# Altium schematic sheet общая плата.SchDoc
size A3
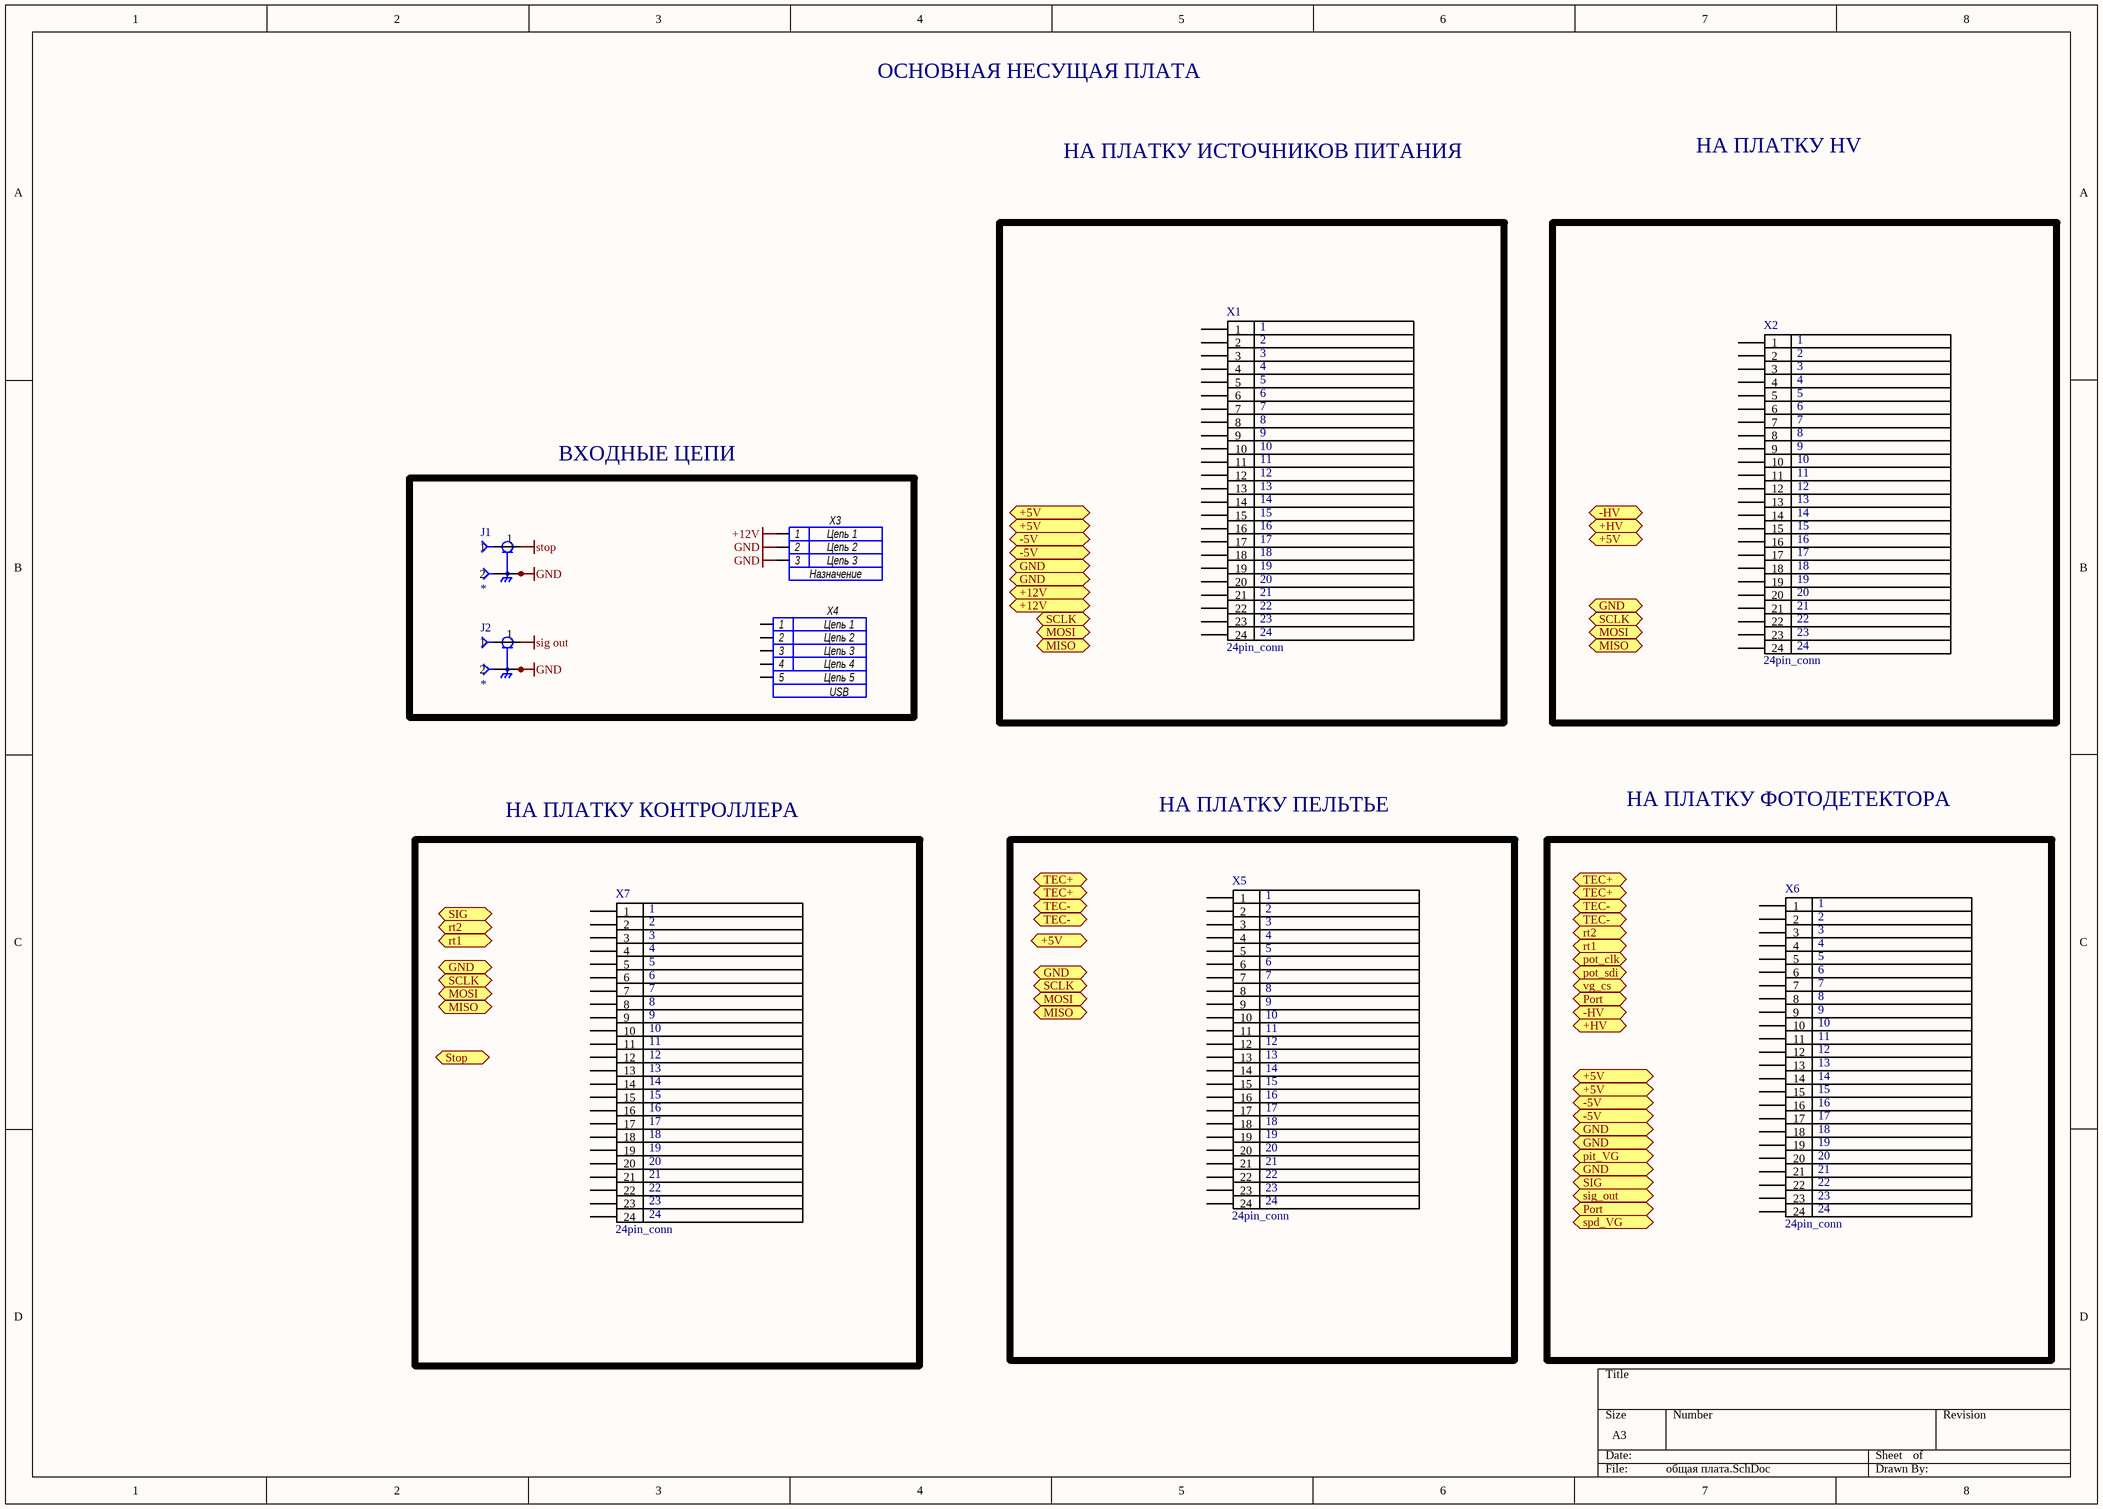
[diagram p0: общая плата.SchDoc]

## Parts
J1  221790-1  [TE_221790-1]  (value not drawn)
J2  221790-1  [TE_221790-1]  (value not drawn)
X1  24pin_conn  [BH-24]
X2  24pin_conn  [BH-24]
X3  Net1: Цепь 1  Net2: Цепь 2  Name: Назначение  Net3: Цепь 3  [DC210]  (hidden comment: Model)
X4  Net4: Цепь 4  Net1: Цепь 1  Net2: Цепь 2  Name: USB  Net3: Цепь 3  Net5: Цепь 5  [USB_TypeB]  (hidden comment: Model)
X5  24pin_conn  [BH-24]
X6  24pin_conn  [BH-24]
X7  24pin_conn  [BH-24]

## Ports
+5V, +12V, +HV, -5V, -HV, GND, MISO, MOSI, pit_VG, Port, pot_clk, pot_sdi, rt1, rt2, SCLK, SIG, sig_out, spd_VG, Stop, TEC+, TEC-, vg_cs

## Nets
+12V: X3.1
GND: J1.2 J1.3 J1.4 J1.5 J2.2 J2.3 J2.4 J2.5 X3.2 X3.3
sig out: J2.1
stop: J1.1

Not connected (* = marked no-connect by the designer): X1 1 2 3 4 5 6 7 8 9 10 11 12 13 14 15 16 17 18 19 20 21 22 23 24; X2 1 2 3 4 5 6 7 8 9 10 11 12 13 14 15 16 17 18 19 20 21 22 23 24; X4 1 2 3 4 5; X5 1 2 3 4 5 6 7 8 9 10 11 12 13 14 15 16 17 18 19 20 21 22 23 24; X6 1 2 3 4 5 6 7 8 9 10 11 12 13 14 15 16 17 18 19 20 21 22 23 24; X7 1 2 3 4 5 6 7 8 9 10 11 12 13 14 15 16 17 18 19 20 21 22 23 24

## Notes on the sheet
- ОСНОВНАЯ НЕСУЩАЯ ПЛАТА
- НА ПЛАТКУ ИСТОЧНИКОВ ПИТАНИЯ
- НА ПЛАТКУ HV
- ВХОДНЫЕ ЦЕПИ
- НА ПЛАТКУ КОНТРОЛЛЕРА
- НА ПЛАТКУ ПЕЛЬТЬЕ
- НА ПЛАТКУ ФОТОДЕТЕКТОРА

## Library data of the parts
J1 J2 = 221790-1: Connector; SMA; PCB; Right Angle; Stainless Steel; 0.6 in.; Beryllium Copper; Number_of_Positions: 1; MF: TE Connectivity; Price: None; EU_RoHS_Compliance: Compliant with Exemptions; Package: None; TE_purchase_URL: https://www.te.com/usa-en/product-221790-1.html?te_bu=Cor&te_type=disp&te_campaign=seda_glo_cor-seda-global-disp-prtnr-fy19-seda-model-bom-cta_sma-317_1&elqCampaignId=32493; MP: 221790-1; Value: *; Availability: Unavailable; SnapEDA_Link: https://www.snapeda.com/parts/221790-1/TE%20Connectivity%20AMP%20Connectors/view-part/496294/?ref=snap; Comment_1: *
X3 = Connector 3: ValueSCH: Model
X4 = Connector 5: ValueSCH: Model